# Altium schematic sheet powercircuit.SchDoc
size A4; SheetNumber: 8; SheetTotal: 8
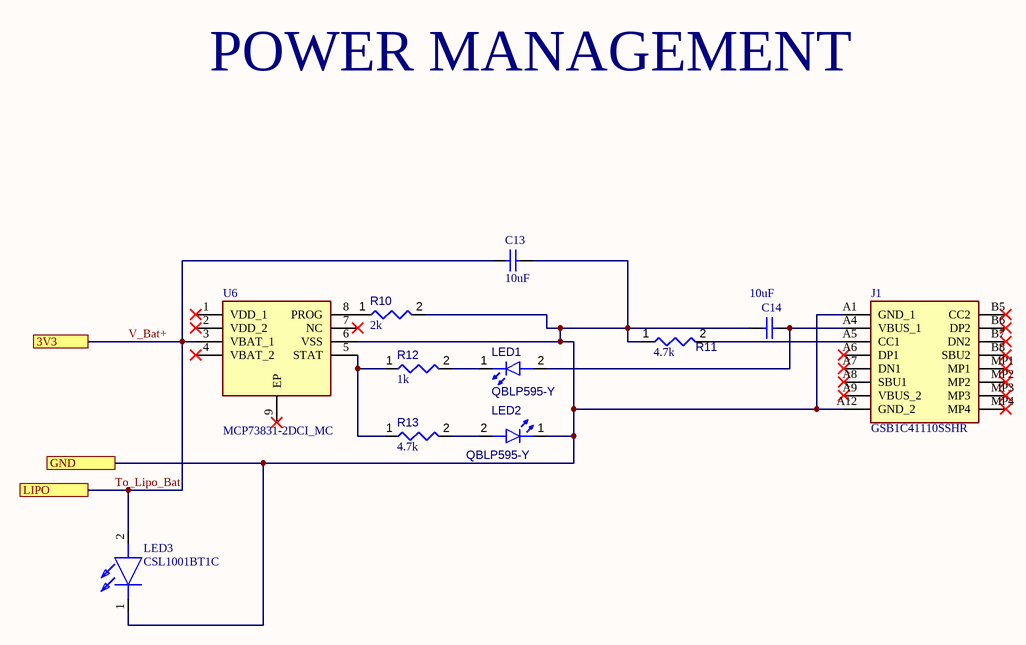
[diagram p0: powercircuit.SchDoc]

## Parts
C13  10uF  [CAPC1608X90X35ML10T15]
C14  10uF  [CAPC1608X90X35ML10T15]
J1  GSB1C41110SSHR  [GSB1C41110SSHR]
LED1  QBLP595-Y  [QTB-QBLP595_V]
LED2  QBLP595-Y  [QTB-QBLP595_V]
LED3  CSL1001BT1C  [CSL1001BT1C]
R10  value 2k  [RESC0402(1005)_L]  (hidden comment: 2KR2J)
R11  value 4.7k  [RESC0402(1005)_L]  (hidden comment: Resistor 4K7  +/-1 % 0402 63 mW)
R12  value 1k  [RESC0402(1005)_L]  (hidden comment: 1KR2J)
R13  value 4.7k  [RESC0402(1005)_L]  (hidden comment: Resistor 4K7  +/-1 % 0402 63 mW)
U6  MCP73831-2DCI_MC  [SON50P300X200X100-9N-D]

## Ports
3V3 (see mainsheet[3C], ESP32-C3-MINI-1U-H4[1B]), GND (see mainsheet[3C], ESP32-C3-MINI-1U-H4[2B]), LIPO (see mainsheet[3D])

## Nets
GND: C13.1 C14.2 J1.A1(GND_1) J1.A12(GND_2) LED2.1(K) LED3.1(K) R10.2 R11.1 U6.6(VSS) ; port GND
To_Lipo_Bat: C13.2 LED3.2(A) U6.3(VBAT_1) ; port 3V3, port LIPO  [also labelled V_Bat+]
NetC14_1: C14.1 J1.A4(VBUS_1) LED1.2(A)
NetJ1_A5: J1.A5(CC1) R11.2
NetLED1_1: LED1.1(K) R12.2
NetLED2_2: LED2.2(A) R13.2
NetR10_1: R10.1 U6.8(PROG)
NetR12_1: R12.1 R13.1 U6.5(STAT)

Not connected (* = marked no-connect by the designer): J1 A6(DP1)* A7(DN1)* A8(SBU1)* A9(VBUS_2)* B5(CC2)* B6(DP2)* B7(DN2)* B8(SBU2)* MP1* MP2* MP3* MP4*; U6 1(VDD_1)* 2(VDD_2)* 4(VBAT_2)* 7(NC)* 9(EP)*

## Notes on the sheet
- POWER MANAGEMENT

## Library data of the parts
C13 C14 = CMP-2100-03643-1: Chip Capacitor, 0.1 uF, +/- 10%, 50 V, -55 to 125 degC, 0603 (1608 Metric), RoHS, Tape and Reel; Manufacturer: Murata; Dielectric Material: Ceramic; Voltage Rating: 50V; Capacitance: 100nF; Dielectric: X7R; Insulation Resistance: 10GR; Case Code (Metric): 1608; Lead Free: LeadFree; Depth: 0.8mm; Number of Pins: 2; Radiation Hardening: No; Case/Package: 0603; Manufacturer URL: http://www.murata.com/; Packaging: TapeandReel; Length: 1.6mm; Contact Plating: Tin; Datasheet URL: http://psearch.en.murata.com/capacitor/product/GRM188R71H104KA93%23.pdf; Tolerance: 10%; Case Code (Imperial): 0603; Min Operating Temperature: -55degC; RoHSCompliant: true; Voltage: 50V; Termination: SMD/SMT; Mount: SurfaceMount; Material: Ceramic; Package Quantity: 1; Height: 0.8mm; Thickness: 0.035inch; REACH SVHC: NoSVHC; Max Operating Temperature: 125degC; Width: 0.8mm; Package Reference: 0603; Voltage Rating (DC): 50V; Datasheet Version: 42675.0; Package Description: 2-Pin Surface Mount Device, Body 1.6 x 0.8 mm
J1 = GSB1C41110SSHR: Connector; Manufacturer_Name: Amphenol Communications Solutions; Datasheet Link: https://cdn.amphenol-cs.com/media/wysiwyg/files/drawing/gsb1c41x10sshr-ax1.pdf; Height: 3.41mm; Manufacturer_Part_Number: GSB1C41110SSHR
LED1 LED2 = CMP-007-00043-3: Chip LED 0402, Yellow, 0.02 A, 3.1 to 3.7 V, -40 to 80 degC, 2-Pin SMD, RoHS, Tape and Reel; Mounting Technology: SMT; Case/Package: 0402; RoHS Compliant: Yes; Pins: 2; Colour: Yellow
LED3 = CSL1001BT1C: LED; Manufacturer_Name: ROHM Semiconductor; Datasheet Link: https://fscdn.rohm.com/en/products/databook/datasheet/opto/led/chip_mono/csl1001bt1(c)-e.pdf; Height: 1.16mm; Manufacturer_Part_Number: CSL1001BT1C; Mouser Part Number: 755-CSL1001BT1C; Mouser Price/Stock: https://www.mouser.co.uk/ProductDetail/ROHM-Semiconductor/CSL1001BT1C?qs=HoCaDK9Nz5fqNTX3Pg0ReA%3D%3D
R10 = CMP-009-00091-2: 2K 0.063W 5% 0402 (1005 Metric)  SMD; Power: 63mW; Case/Package: 0402; Mounting Technology: SMT; Tolerance: 5%; Pins: 2
R11 R13 = CMP-009-00158-3: Chip Resistor, 4,7 kOhms, +/-1 %, 63 mW, -55 to 155 degC, 0402; Power: 63mW; Tolerance: 1%; Max Operating Temperature: 155°C; Pins: 2; Min Operating Temperature: -55°C; Case/Package: 0402
R12 = CMP-009-00075-2: 1K 0.063W 5% 0402 (1005 Metric)  SMD; Power: 63mW; Pins: 2; Mounting Technology: SMT; Case/Package: 0402; Tolerance: 5%
U6 = MCP73831-2DCI_MC: Integrated Circuit; Manufacturer_Name: Microchip; Manufacturer_Part_Number: MCP73831-2DCI/MC; Datasheet Link: https://www.arrow.com/en/products/mcp73831-2dcimc/microchip-technology; Height: 1mm; Mouser Part Number: 579-MCP73831-2DCI/MC; Mouser Price/Stock: https://www.mouser.co.uk/ProductDetail/Microchip-Technology/MCP73831-2DCI-MC?qs=hH%252BOa0VZEiBQ%2FrptDRXKdg%3D%3D; Arrow Part Number: MCP73831-2DCI/MC; Arrow Price/Stock: https://www.arrow.com/en/products/mcp73831-2dcimc/microchip-technology?region=nac